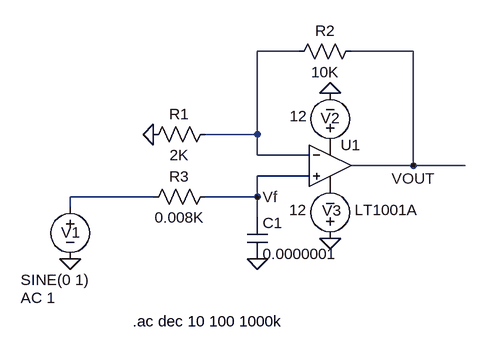
[diagram p0: schematic Low-Pass Filter using Op Amp.asc]
Low-Pass Filter using Op Amp.asc, the LTspice schematic file:
Version 4
SHEET 1 880 680
WIRE 224 -48 160 -48
WIRE 400 -48 304 -48
WIRE 160 80 160 -48
WIRE 160 80 80 80
WIRE 160 112 160 80
WIRE 240 112 160 112
WIRE 400 128 400 -48
WIRE 400 128 304 128
WIRE 480 128 400 128
WIRE 240 144 160 144
WIRE 0 176 -128 176
WIRE 160 176 160 144
WIRE 160 176 80 176
WIRE -128 192 -128 176
WIRE 160 208 160 176
FLAG 0 80 0
FLAG -128 272 0
FLAG 160 272 0
FLAG 272 16 0
FLAG 272 240 0
FLAG 400 128 VOUT
FLAG 160 176 Vf
SYMBOL res 96 64 R90
WINDOW 0 0 56 VBottom 2
WINDOW 3 32 56 VTop 2
SYMATTR InstName R1
SYMATTR Value 2K
SYMBOL res 320 -64 R90
WINDOW 0 0 56 VBottom 2
WINDOW 3 32 56 VTop 2
SYMATTR InstName R2
SYMATTR Value 10K
SYMBOL res 96 160 R90
WINDOW 0 0 56 VBottom 2
WINDOW 3 32 56 VTop 2
SYMATTR InstName R3
SYMATTR Value 0.008K
SYMBOL voltage -128 176 R0
WINDOW 0 -14 55 Left 2
WINDOW 3 -76 128 Left 2
WINDOW 123 -76 156 Left 2
WINDOW 39 0 0 Left 0
SYMATTR InstName V1
SYMATTR Value SINE(0 1)
SYMATTR Value2 AC 1
SYMBOL OpAmps\\LT1001A 272 64 R0
WINDOW 3 38 132 Left 2
SYMATTR InstName U1
SYMBOL voltage 272 112 R180
WINDOW 0 -15 57 Left 2
WINDOW 3 35 60 Left 2
WINDOW 123 0 0 Left 0
WINDOW 39 0 0 Left 0
SYMATTR InstName V2
SYMATTR Value 12
SYMBOL voltage 272 256 R180
WINDOW 0 -17 59 Left 2
WINDOW 3 36 60 Left 2
WINDOW 123 0 0 Left 0
WINDOW 39 0 0 Left 0
SYMATTR InstName V3
SYMATTR Value 12
SYMBOL cap 144 208 R0
SYMATTR InstName C1
SYMATTR Value 0.0000001
TEXT -32 368 Left 2 !.ac dec 10 100 1000k

The netlist it stands for:
* Low-Pass Filter using Op Amp.asc
R1 N001 0 2K
R2 VOUT N001 10K
R3 Vf N002 0.008K
V1 N002 0 SINE(0 1) AC 1
XU1 Vf N001 P001 P002 VOUT LT1001  ; LT1001A, pins In+ In- V+ V- OUT
V2 P001 0 12
V3 0 P002 12
C1 Vf 0 0.0000001
.ac dec 10 100 1000k
.lib LTC.lib
.backanno
.end